# Altium schematic sheet HotelRail.SchDoc
size A; SheetNumber: 5; SheetTotal: 5
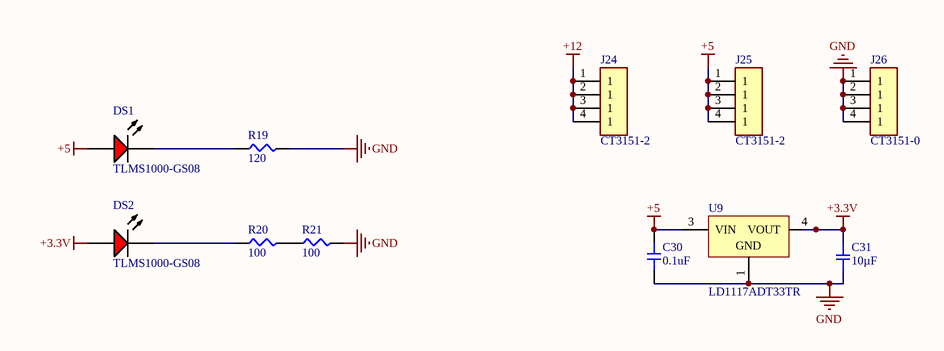
[diagram p0: HotelRail.SchDoc]

## Parts
C30  0.1uF
C31  10µF  [SMD-0603-RES]
DS1  TLMS1000-GS08  [VISH-TLMS1000_V]
DS2  TLMS1000-GS08  [VISH-TLMS1000_V]
J24  CT3151-2  [CALTEST_CT3151-2]
J25  CT3151-2  [CALTEST_CT3151-2]
J26  CT3151-0  [CT3151-0]
R19  120  [SMD-0603-RES]
R20  100  [SMD-0603-RES]
R21  100  [SMD-0603-RES]
U9  LD1117ADT33TR  [TO-252_L]

## Nets
+3.3V: C31.1 DS2.1(A) U9.4(VOUT)
+5: C30.2 DS1.1(A) J25.1 J25.2(1) J25.3(1) J25.4(1) U9.3(VIN)
+12: J24.1 J24.2(1) J24.3(1) J24.4(1)
GND: C30.1 C31.2 J26.1 J26.2(1) J26.3(1) J26.4(1) R19.2 R21.2 U9.1(GND)
NetDS1_2: DS1.2(K) R19.1
NetDS2_2: DS2.2(K) R20.1
NetR20_2: R20.2 R21.1

## Library data of the parts
C30 = C1608X7R1H104K080AA: 0.1uF, 0603, +/- 10%, 50V, X7R; Tolerance: +/- 10%; ID: 1; Mfg: TDK Corporation; TempOperatingMax: 125; TempOperatingMin: -55; TempStorageMax: 40; TempStorageMin: 5; Value: 0.1uF; MfgPN: C1608X7R1H104K080AA; Voltage: 50V; Material: X7R; RoHS: True; SMD: True; Footprint: 0603; Supplier 1: Digi-Key; Supplier Part Number 1: 445-1314-1-ND
C31 = GRM188R60J106ME47D: CAP CER 10UF 6.3V X5R 0603; Manufacturer: Murata Electronics North America; Factory Stock: 0; Unit Price (USD): 0.15; Minimum Quantity: 1; Tolerance: ±20%; Part Number: GRM188R60J106ME47D; Datasheets: http://www.murata.com/~/media/webrenewal/support/library/catalog/products/capacitor/mlcc/c02e.pdf; Image: //media.digikey.com/Renders/Murata%20Renders/ZRB-SERIES-0402.jpg; Digi-Key Part Number: 490-3896-1-ND; Quantity Available: 1578882; @ qty: 0; Packaging: Cut Tape (CT); Series: GRM; Part Status: Active; Value: 10µF; Voltage: 6.3V; Temperature Coefficient: X5R; Operating Temperature: -55°C ~ 85°C; Features: -; Ratings: -; Applications: General Purpose; Mounting Type: Surface Mount, MLCC; Package / Case: 0603 (1608 Metric); Size / Dimension: 0.063" L x 0.031" W (1.60mm x 0.80mm); Height - Seated (Max): -; Thickness (Max): 0.035" (0.90mm); Lead Spacing: -; Lead Style: -
DS1 DS2 = CMP-2000-07254-1: Low Current LED, 40 mW, 1.8 V, -40 to 100 degC, 2-Pin SMD (0603), RoHS, Tape and Reel; Manufacturer: Vishay; Lens Shape: Rectangular; Automotive Qualification Standard: AEC-Q100; Wavelength Typ: 636nm; SVHC: ToBeAdvised; LED Colour: Red; Bulb Size: 1.6mmx0.8mm; Forward Voltage: 1.8V; Luminous Intensity: 4mcd; Forward Current If: 2mA; Viewing Angle: 80°; Datasheet Version: Rev. 1.7, 02/2011; Datasheet URL: https://datasheet.ciiva.com/5798/1698881-5798337.pdf; LED Mounting: SMD; Packaging: CutTape; Package Reference: TLMS1000; Manufacturer URL: http://www.vishay.com/; Mounting Technology: SurfaceMount; Product Range: -; Package Description: 2-Pin Surface Mount Device, Body 1.6 x 0.8 mm; MSL: MSL2-1year; Manufacturer Part Number: TLMS1000-GS08
J24 J25 = CT3151-2_1: Banana Jack Connector Standard Banana Solder Red; MF: {'manufacturer': u'Cal Test'}; Package: None; Price: None; Value: *; MP: CT3151-2; Availability: Unavailable
J26 = CT3151-2: Banana Jack Connector Standard Banana Solder Red; MF: {'manufacturer': u'Cal Test'}; Package: None; Price: None; Value: *; MP: CT3151-2; Availability: Unavailable
R19 = ERJ-3EKF1200V: RES SMD 120 OHM 1% 1/10W 0603; Manufacturer: Panasonic Electronic Components; Factory Stock: 0; Unit Price (USD): 0.00379; @ qty: 1500; Minimum Quantity: 1; Power (Watts): 0.1W, 1/10W; Temperature Coefficient: ±100ppm/°C; Part Number: ERJ-3EKF1200V; Datasheets: http://industrial.panasonic.com/www-cgi/jvcr13pz.cgi?E+PZ+3+AOA0002+ERJ3EKF1200V+7+WW; Image: //media.digikey.com/Photos/Panasonic%20Photos/MFG_ERJ-P6W%20Series.jpg; Digi-Key Part Number: P120HCT-ND; Quantity Available: 84623; Packaging: Cut Tape (CT); Series: ERJ; Part Status: Active; Value: 120; Tolerance: ±1%; Composition: Thick Film; Features: Automotive AEC-Q200; Operating Temperature: -55°C ~ 155°C; Package / Case: 0603 (1608 Metric); Supplier Device Package: 0603; Size / Dimension: 0.063" L x 0.031" W (1.60mm x 0.80mm); Height - Seated (Max): 0.022" (0.55mm); Number of Terminations: 2; Failure Rate: -
R20 R21 = ERJ-3EKF1000V: RES SMD 100 OHM 1% 1/10W 0603; Manufacturer: Panasonic Electronic Components; Factory Stock: 0; Unit Price (USD): 0.00379; @ qty: 1500; Minimum Quantity: 1; Power (Watts): 0.1W, 1/10W; Temperature Coefficient: ±100ppm/°C; Part Number: ERJ-3EKF1000V; Datasheets: http://industrial.panasonic.com/www-cgi/jvcr13pz.cgi?E+PZ+3+AOA0002+ERJ3EKF1000V+7+WW; Image: //media.digikey.com/Photos/Panasonic%20Photos/MFG_ERJ-P6W%20Series.jpg; Digi-Key Part Number: P100HCT-ND; Quantity Available: 1544120; Packaging: Cut Tape (CT); Series: ERJ; Part Status: Active; Value: 100; Tolerance: ±1%; Composition: Thick Film; Features: Automotive AEC-Q200; Operating Temperature: -55°C ~ 155°C; Package / Case: 0603 (1608 Metric); Supplier Device Package: 0603; Size / Dimension: 0.063" L x 0.031" W (1.60mm x 0.80mm); Height - Seated (Max): 0.022" (0.55mm); Number of Terminations: 2; Failure Rate: -
U9 = CMP-0244-00137-1: 1A, Low Drop Positive Voltage Regulator, 3.3V, 3-Pin DPAK, Tape and Reel; Manufacturer: STMicroelectronics; ComponentLink2URL: http://www.st.com/internet/com/TECHNICAL_RESOURCES/TECHNICAL_LITERATURE/DATASHEET/CD00002116.pdf; ComponentLink2Description: Datasheet; ComponentLink1URL: http://www.st.com; PackageDescription: 3-Pin Transistor Outline Package 2.28 mm Pitch, 9.7 mm Lead Span (DPAK); ComponentLink1Description: Manufacturer URL; PackageVersion: 2011; PackageReference: TO-252; DatasheetVersion: 2/12/2011; Manufacturer Part Number: LD1117ADT33TR